# EAGLE design mainboard_ESP32 DevBoard (EAGLE 9.6.2)
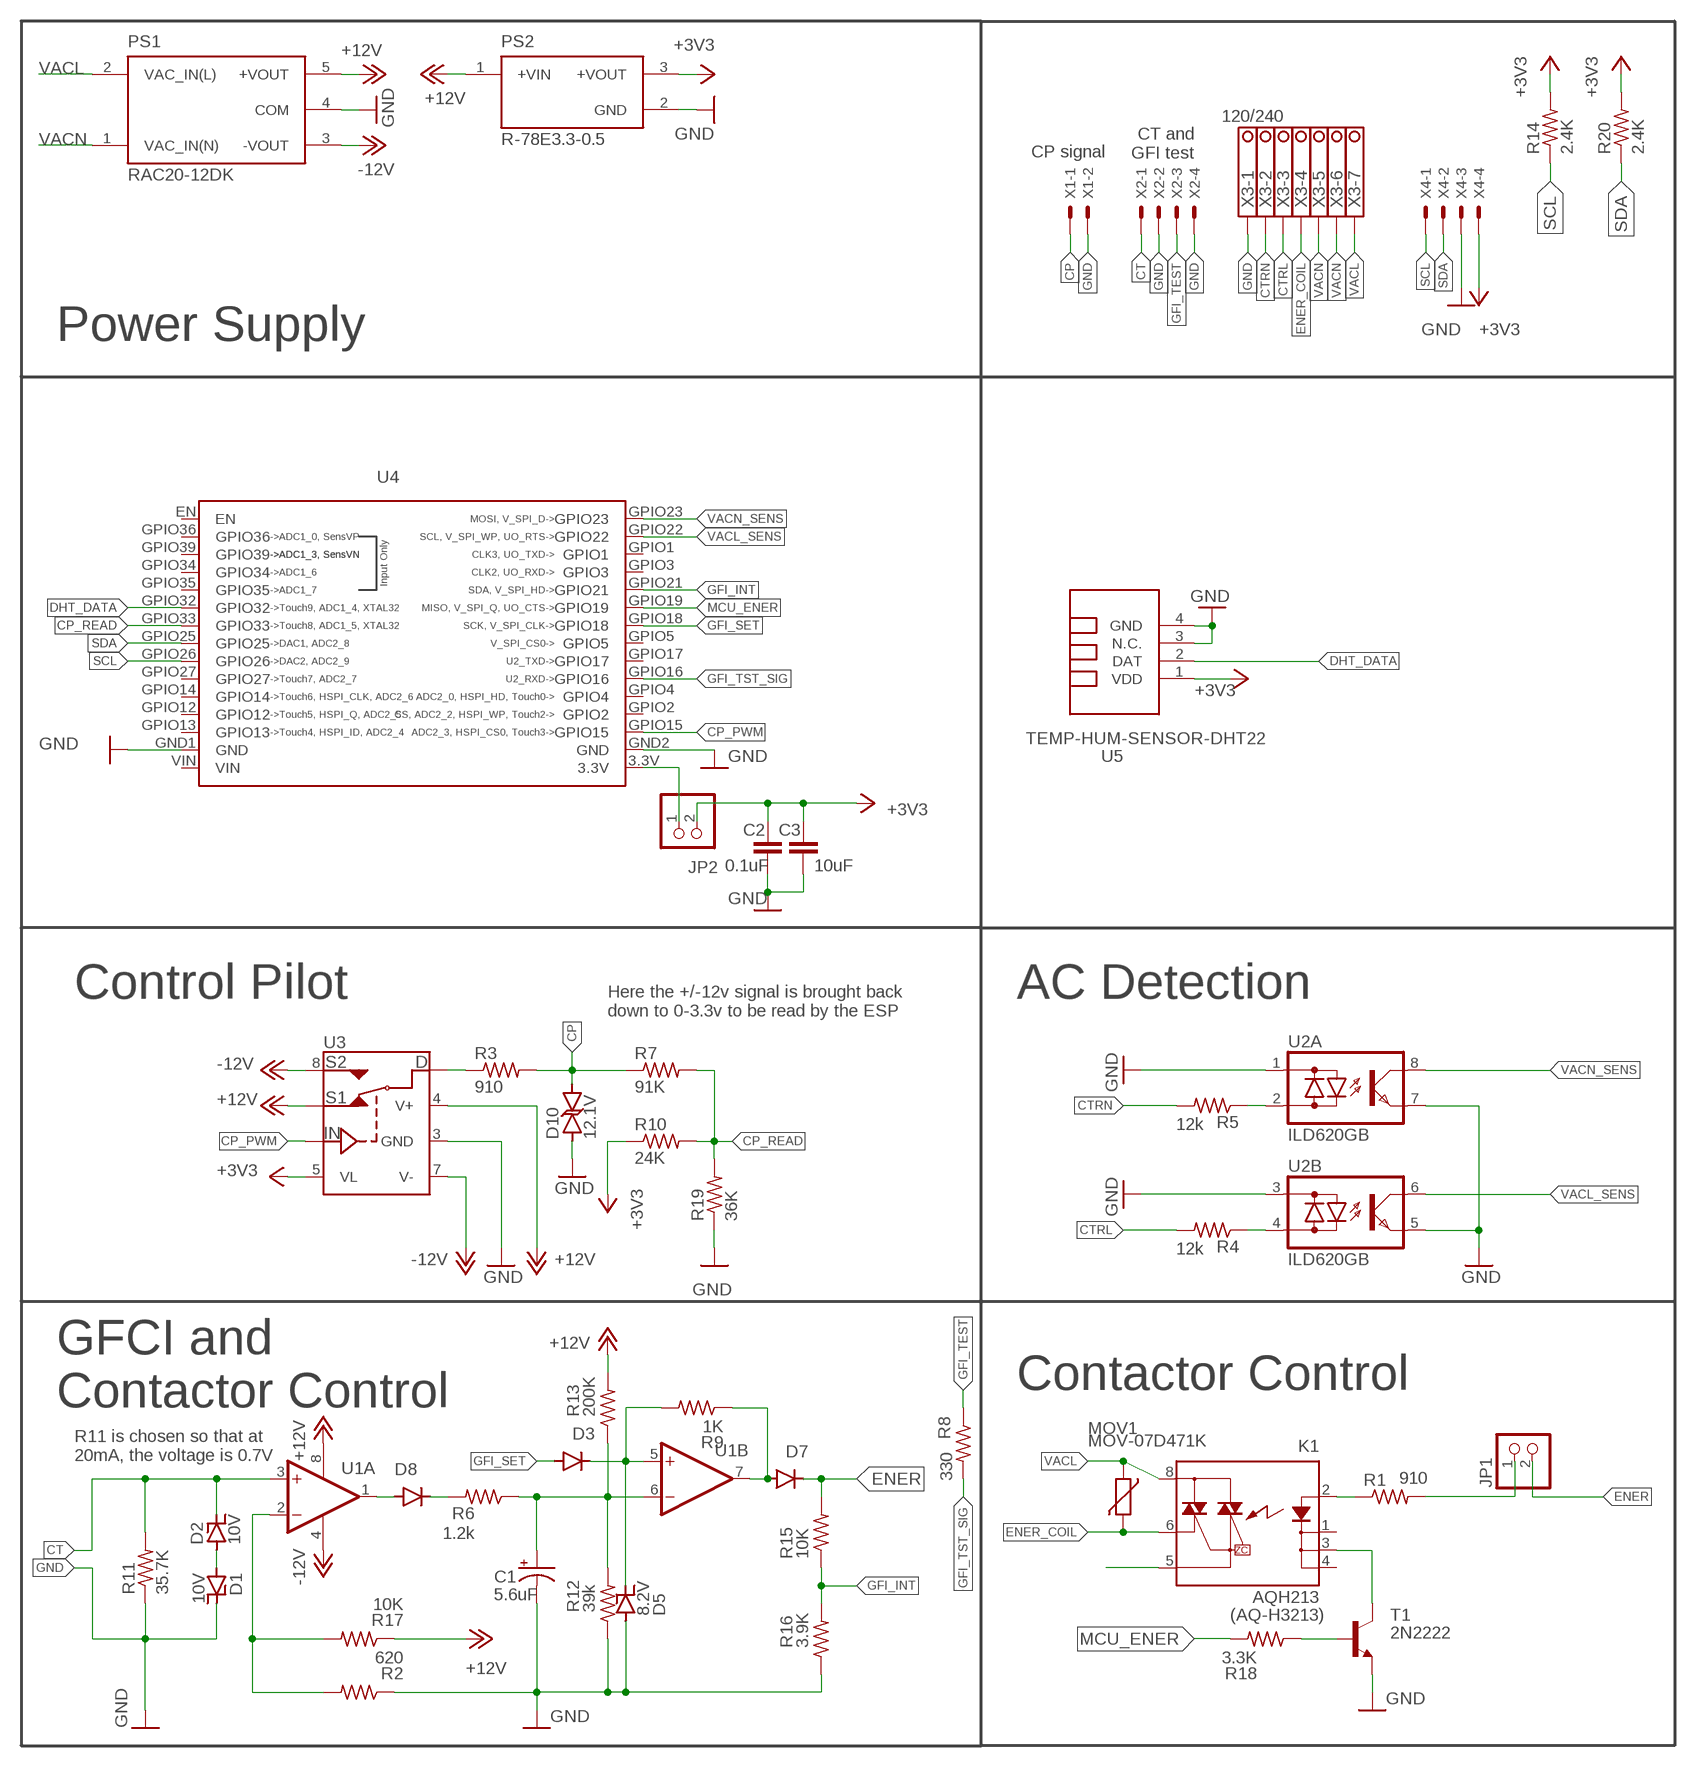
[diagram p0: schematic, sheet 1]

## Parts
C1  5.6uF  CPOL-USE2-5  [E2-5]
C2  0.1uF  C-EU025-025X050  [C025-025X050]
C3  10uF  C-EU025-050X050  [C025-050X050]
D1  10V  ZENER  [DO35-7]
D2  10V  ZENER  [DO35-7]
D3  1N4148DO35-7  [DO35-7]
D5  8.2V  ZENER  [DO35-7]
D7  1N4148DO35-7  [DO35-7]
D8  1N4148DO35-7  [DO35-7]
D10  12.1V  P6KE15CAL  [DO15]
JP1  PINHD-1X2  [1X02]
JP2  PINHD-1X2/90  [1X02/90]
K1  AQH213  [DIL07]
MOV1  MOV-07D471K  [DISC-7]
PS1  RAC20-12DK  [CONV_RAC20-12DK]
PS2  R-78E3.3-0.5  [CONV_R-78E3.3-0.5]
R1  910  RESISTORL  [0204/7-L]
R2  620  RESISTORL  [0204/7-L]
R3  910  RESISTORL  [0204/7-L]
R4  12k  RESISTORL  [0204/7-L]
R5  12k  RESISTORL  [0204/7-L]
R6  1.2k  RESISTORL  [0204/7-L]
R7  91K  RESISTORL  [0204/7-L]
R8  330  RESISTORL  [0204/7-L]
R9  1K  RESISTORL  [0204/7-L]
R10  24K  RESISTORL  [0204/7-L]
R11  35.7K  RESISTORL  [0204/7-L]
R12  39k  RESISTORL  [0204/7-L]
R13  200K  RESISTORL  [0204/7-L]
R14  2.4K  RESISTORL  [0204/7-L]
R15  10K  RESISTORL  [0204/7-L]
R16  3.9K  RESISTORL  [0204/7-L]
R17  10K  RESISTORL  [0204/7-L]
R18  3.3K  RESISTORL  [0204/7-L]
R19  36K  RESISTORL  [0204/7-L]
R20  2.4K  RESISTORL  [0204/7-L]
T1  2N2222  2N2222-NPN-TO92-EBC  [TO92-EBC]
U1  LM833N  [DIL08-LONG]
U2  ILD620GB  [DIL8]
U3  DG419DJ-L  [DIL08-LONG]
U4  ESP32-DOIT-V1  [ESP32-DOIT-V1]
U5  TEMP-HUM-SENSOR-DHT22  [TEMP-HUM-SENSOR-DHT22]
X1  JST-XH-02-PIN-LONG-PAD  [JST-XH-02-PACKAGE-LONG-PAD]
X2  JST-XH-04-PIN-LONG-PAD  [JST-XH-04-PACKAGE-LONG-PAD]
X3  1751293  [1751293]
X4  JST-XH-04-PIN-LONG-PAD  [JST-XH-04-PACKAGE-LONG-PAD]

## Nets
+3V3: C2.1 C3.1 JP2.2 PS2.3(+VOUT) R10.1 R14.2 R20.2 U3.5(VL) U5.1(VDD) X4.4
+12V: PS1.5(+VOUT) PS2.1(+VIN) R13.2 R17.1 U1.8(P:V+) U3.2(S1) U3.4(V+)
-12V: PS1.3(-VOUT) U1.4(P:V-) U3.7(V-) U3.8(S2)
CP: D10.C R3.2 R7.1 X1.1
CP_PWM: U3.6(IN) U4.GPIO15
CP_READ: R7.2 R10.2 R19.2 U4.GPIO33
CT: D2.C R11.2 U1.3(A:+IN) X2.1
CTRL [Mains]: R4.2 X3.3
CTRN [Mains]: R5.2 X3.2
DHT_DATA: U4.GPIO32 U5.2(DAT)
ENER: D7.C JP1.2 R15.2
ENER_COIL [Mains]: K1.6(DS3) MOV1.P$2 X3.4
GFI_INT: R15.1 R16.2 U4.GPIO21
GFI_SET: D3.A U4.GPIO18
GFI_TEST: R8.1 X2.3
GFI_TST_SIG: R8.2 U4.GPIO16
GND: C1.- C2.2 C3.2 D1.C D5.A D10.A PS1.4(COM) PS2.2(GND) R2.1 R11.1 R12.1 R16.1 R19.1 T1.E U2.1(A:AC1) U2.3(B:AC1) U2.5(B:E) U2.7(A:E) U3.3(GND) U4.GND1(GND) U4.GND2(GND) U5.3(N.C.) U5.4(GND) X1.2 X2.2 X2.4 X3.1 X4.3
MCU_ENER: R18.2 U4.GPIO19
N$1: K1.2(A) R1.1
N$2: R2.2 R17.2 U1.2(A:-IN)
N$3: JP1.1 R1.2
N$4: D7.A R9.1 U1.7(B:OUT)
N$5: D1.A D2.A
N$6: D8.C R6.2
N$8: R3.1 U3.1(D)
N$9: C1.+ R6.1 R12.2 R13.1 U1.6(B:-IN)
N$10: JP2.1 U4.3.3V
N$11 [Mains]: K1.5(DS2)
N$12: R18.1 T1.B
N$13: D3.C D5.C R9.2 U1.5(B:+IN)
N$14: K1.3(K1) T1.C
N$15: D8.A U1.1(A:OUT)
N$16 [Mains]: R5.1 U2.2(A:AC2)
N$17 [Mains]: R4.1 U2.4(B:AC2)
SCL: R14.1 U4.GPIO26 X4.1
SDA: R20.1 U4.GPIO25 X4.2
VACL [Mains]: K1.8(DS1) MOV1.P$1 PS1.2(VAC_IN(L)) X3.7
VACL_SENS: U2.6(B:C) U4.GPIO22
VACN [Mains]: PS1.1(VAC_IN(N)) X3.5 X3.6
VACN_SENS: U2.8(A:C) U4.GPIO23
Unconnected: K1.1(K) K1.4(K2) U4.EN U4.GPIO1 U4.GPIO2 U4.GPIO3 U4.GPIO4 U4.GPIO5 U4.GPIO12 U4.GPIO13 U4.GPIO14 U4.GPIO17 U4.GPIO27 U4.GPIO34 U4.GPIO35 U4.GPIO36 U4.GPIO39

## Notes on the sheet
- 120/240
- CT and
  GFI test
- CP signal
- Power Supply
- Control Pilot | AC Detection
- Here the +/-12v signal is brought back 
  down to 0-3.3v to be read by the ESP
- Contactor Control
- GFCI and 
  Contactor Control
- R11 is chosen so that at
  20mA, the voltage is 0.7V
- (AQ-H3213)

## Power pins joined to a net without a drawn wire
VIN: U4.VIN

## Library data of the parts
C1 = rcl:CPOL-US: POLARIZED CAPACITOR, American symbol; SPICEPREFIX: C
C2 C3 = rcl:C-EU: CAPACITOR, European symbol; SPICEPREFIX: C
D1 D2 D5 = Passive:ZENER
D3 D7 D8 = diode:1N4148: DIODE high speed (Philips)
D10 = EVSE:P6KE15CA
JP1 JP2 = pinhead:PINHD-1X2: PIN HEADER
K1 = relay:AQH*213: SOLID STATE RELAY NAiS Source: http://www.mew-europe.com/.. en_ds_61613_0000.pdf; OC_FARNELL: unknown; OC_NEWARK: unknown
MOV1 = EVSE:MOV-07D471K
PS1 = EVSE:RAC20-12DK: AC/DC CONVERTER 5V 20W, DUAL; DESCRIPTION: 20W AC/DC-Converter 'POWERLINE' 2x1 3kV reg; DIGI-KEY_PART_NUMBER: 945-3239-ND; DIGI-KEY_PURCHASE_URL: https://www.digikey.com/product-detail/en/recom-power/RAC20-12DK/945-3239-ND/9644720?utm_source=snapeda&utm_medium=aggregator&utm_campaign=symbol; MF: Recom Power; MP: RAC20-12DK; PACKAGE: DIP-5 Recom Power
PS2 = EVSE:R-78E3.3-0.5: 0.5 Amp SIP3 Single Output; DESCRIPTION: 0.5A DC/DC-Converter 'INNOLINE' SIP3 reg; DIGI-KEY_PART_NUMBER: 945-1661-5-ND; DIGI-KEY_PURCHASE_URL: https://www.digikey.com/product-detail/en/recom-power/R-78E3.3-0.5/945-1661-5-ND/3593412?utm_source=snapeda&utm_medium=aggregator&utm_campaign=symbol; MF: Recom Power; MP: R-78E3.3-0.5; PACKAGE: SIP-3 Recom Power
R1-R20 = Passive:RESISTOR
T1 = transistor-neu-to92:*-NPN-: NPN Transistror
U1 = EVSE:LM833
U2 = EVSE:ILD620
U3 = EVSE:DG419: The DG419 is single-pole/double-throw (SPDT) with one normally closed switch and one normally open switch. Switching times are less than 175ns max for tON and less than 145ns max for tOFF. Operation is from a single +10V to +30V supply, or bipolar ±4.5V to ±20V supplies. The improved DG417/DG418/DG419 are fabricated with a 44V silicon-gate process. MAXIM <https://www.maximintegrated.com/en/products/analog/analog-switches-multiplexers/DG419.html>
U4 = ESP32:ESP32-DOIT-V1: ESP32 DOIT dev board V1. Dimensions measure with calipers.
U5 = diy-modules:TEMP-HUM-SENSOR-DHT22: DHT22 - digital humidity & temperature sensor Also known as: AM2302 AM2302 datasheet available here: http://akizukidenshi.com/download/ds/aosong/AM2302.pdf Click here to find device on ebay.com <http://www.ebay.com/sch/dht22+digital+sensor>
X1 = Rembrandt Electronics - JST XH Connectors v1-0:JST-XH-02-PIN: JST XH Connector 2 Pin Wire to board connector. Pitch: 2,54 mm, (0.100") Number of pins: 2 Created by Rembrandt Electronics www.rembrandtelectronics.com
X2 X4 = Rembrandt Electronics - JST XH Connectors v1-0:JST-XH-04-PIN: JST XH Connector 2 Pin Wire to board connector. Pitch: 2,54 mm, (0.100") Number of pins: 4 Created by Rembrandt Electronics www.rembrandtelectronics.com
X3 = con-phoenix-350:1751293: MKDS 1/ 7-3,5 Printklemme Nennstrom: 10 A Bemessungsspannung: 160 V Raster: 3,5 mm Polzahl: 7 Montageart: Löten Anschlussart: Schraubanschluss Anschlussrichtung vom Leiter zur Platine: 0° Source: http://eshop.phoenixcontact.com .. 1751293.pdf; OC_FARNELL: unknown; OC_NEWARK: unknown

## Net classes
1 Mains: clearance 1.2 mm

## Board
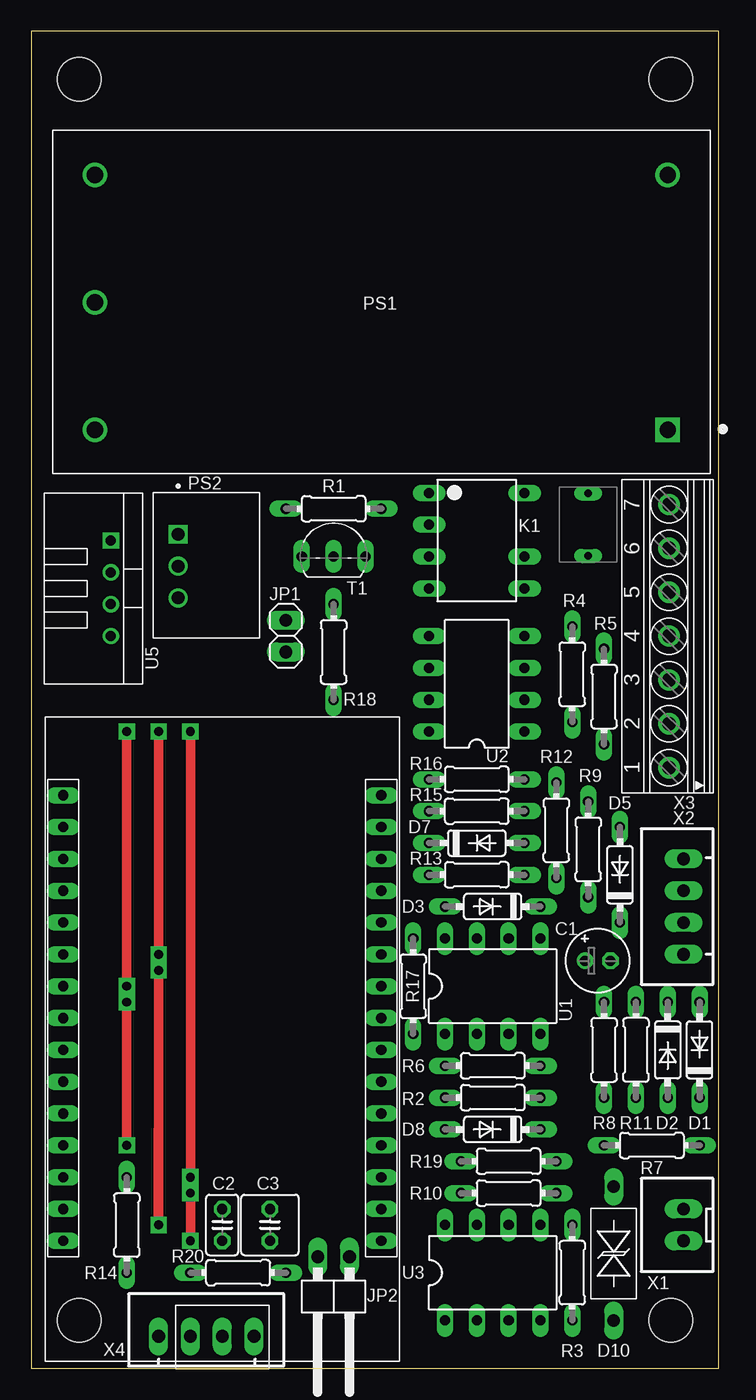
[diagram p1: board, top side]
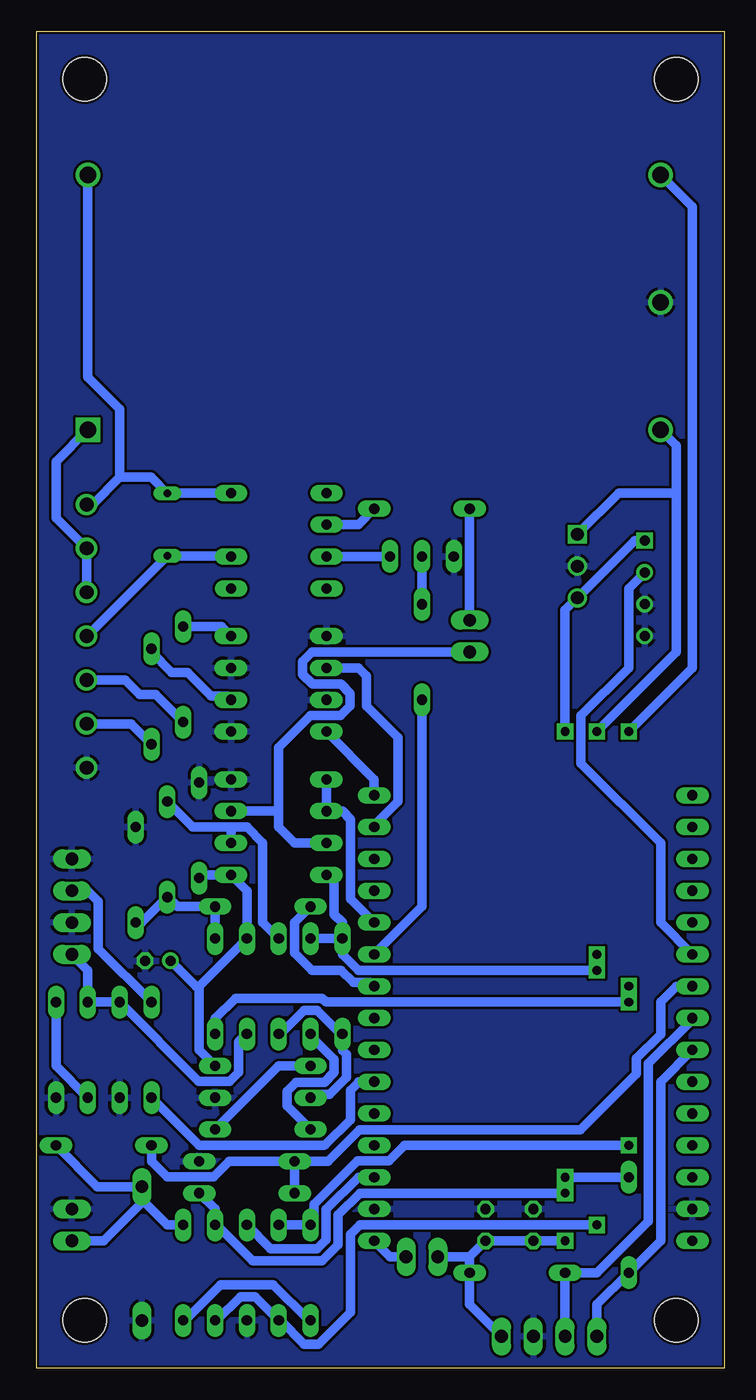
[diagram p2: board, bottom side, seen from below]

Size 54.86 x 106.68 mm. Coordinates in mm from the lower left corner, seen from the top.
Outline: 0,0 54.86,0 54.86,106.68 0,106.68 0,0
Copper layers (1*16): Top 0.035mm / dielectric 1.5mm / Bottom 0.035mm
Design rules "CNC *": minimum track width 0.25mm, minimum drill 0.6mm, track to track 0.2mm, track to pad 0.2mm, pad to pad 6mil, via to via 0.2mm, smd to smd 0.15mm, copper to edge 0.15mm, drill to drill 6mil, minimum pad ring 0.25mm, minimum via ring 0.3mm, stop-mask expansion 4mil, vias tented up to drill 0mil, thermal gap 10mil
Holes 3.5 mm at 3.81,3.81 51.05,3.81 51.05,102.87 3.81,102.87

### Footprints (pad centres in the part's own frame; a part is rotated, then mirrored left to right if it is on the bottom)
E2-5 = drill 0.813 pad 1.27: + -1.016,0 | drill 0.813 pad 1.27 octagon: - 1.016,0
C025-025X050 = drill 0.813 octagon: 1 -1.27,0; 2 1.27,0
C025-050X050 = drill 0.813 octagon: 1 -1.27,0; 2 1.27,0
DO35-7 = drill 0.813 long: A 3.81,0; C -3.81,0
DO15 = drill 1 long: A 5.334,0; C -5.334,0
1X02 = drill 1.016 long: 1 -1.27,0; 2 1.27,0
1X02/90 = drill 1.016 long: 1 -1.27,-3.81; 2 1.27,-3.81
DIL07 = drill 0.8 long: 1 -3.81,-3.81; 2 -1.27,-3.81; 3 1.27,-3.81; 4 3.81,-3.81; 5 3.81,3.81; 6 1.27,3.81; 8 -3.81,3.81
DISC-7 = drill 0.6 long: P$1 -2.5,0; P$2 2.5,0
CONV_RAC20-12DK = drill 1.3 pad 1.95 square: 1 -22.86,10.2 | drill 1.3 pad 1.95: 2 -22.86,-10.12; 3 22.86,-10.12; 4 22.86,0.04; 5 22.86,10.2
CONV_R-78E3.3-0.5 = drill 1 square: 1 -2.54,-2.25 | drill 1: 2 0,-2.25; 3 2.54,-2.25
0204/7-L = drill 0.813 long: 1 -3.81,0; 2 3.81,0
TO92-EBC = drill 0.813 long: B 0,-1.27; C 2.54,-1.27; E -2.54,-1.27
DIL08-LONG = drill 0.813 long: 1 -3.81,-3.81; 2 -1.27,-3.81; 3 1.27,-3.81; 4 3.81,-3.81; 5 3.81,3.81; 6 1.27,3.81; 7 -1.27,3.81; 8 -3.81,3.81
DIL8 = drill 0.813 long: 1 -3.81,-3.81; 2 -1.27,-3.81; 3 1.27,-3.81; 4 3.81,-3.81; 5 3.81,3.81; 6 1.27,3.81; 7 -1.27,3.81; 8 -3.81,3.81
ESP32-DOIT-V1 = drill 0.813 long: 3.3V 12.7,-15.24; EN -12.7,20.32; GND1 -12.7,-12.7; GND2 12.7,-12.7; GPIO1 12.7,15.24; GPIO2 12.7,-7.62; GPIO3 12.7,12.7; GPIO4 12.7,-5.08; GPIO5 12.7,2.54; GPIO12 -12.7,-7.62; GPIO13 -12.7,-10.16; GPIO14 -12.7,-5.08; GPIO15 12.7,-10.16; GPIO16 12.7,-2.54; GPIO17 12.7,0; GPIO18 12.7,5.08; GPIO19 12.7,7.62; GPIO21 12.7,10.16; GPIO22 12.7,17.78; GPIO23 12.7,20.32; GPIO25 -12.7,2.54; GPIO26 -12.7,0; GPIO27 -12.7,-2.54; GPIO32 -12.7,7.62; GPIO33 -12.7,5.08; GPIO34 -12.7,12.7; GPIO35 -12.7,10.16; GPIO36 -12.7,17.78; GPIO39 -12.7,15.24; VIN -12.7,-15.24
TEMP-HUM-SENSOR-DHT22 = drill 0.8 square: 1 -3.81,0 | drill 0.8: 2 -1.27,0; 3 1.27,0; 4 3.81,0
JST-XH-02-PACKAGE-LONG-PAD = drill 1.016 long: 1 -1.27,0; 2 1.27,0
JST-XH-04-PACKAGE-LONG-PAD = drill 1.016 long: 1 -3.81,0; 2 -1.27,0; 3 1.27,0; 4 3.81,0
1751293 = drill 1.1 pad 1.7: 1 -10.5,-0.1; 2 -7,-0.1; 3 -3.5,-0.1; 4 0,-0.1; 5 3.5,-0.1; 6 7,-0.1; 7 10.5,-0.1

### Placement (x,y rotation side)
C1  45.21,32.51 0 top
C2  15.24,11.43 90 top
C3  19.05,11.43 90 top
D1  53.34,25.4 90 top
D2  50.8,25.4 270 top
D3  36.83,36.83 180 top
D5  46.99,39.37 90 top
D7  35.56,41.91 0 top
D8  36.83,19.05 180 top
D10  46.48,9.14 270 top
JP1  20.32,58.42 270 top
JP2  24.13,5.08 180 top
K1  35.56,66.04 270 top
MOV1  44.45,67.31 270 top
PS1  27.94,85.09 180 top
PS2  13.97,64.01 270 top
R1  24.13,68.58 180 top
R2  36.83,21.59 180 top
R3  43.18,7.62 90 top
R4  43.18,55.37 270 top
R5  45.72,53.59 270 top
R6  36.83,24.13 180 top
R7  49.53,17.78 180 top
R8  45.72,25.4 270 top
R9  44.45,41.4 270 top
R10  38.1,13.97 180 top
R11  48.26,25.4 90 top
R12  41.91,42.93 270 top
R13  35.56,39.37 180 top
R14  7.62,11.43 90 top
R15  35.56,44.45 0 top
R16  35.56,46.99 180 top
R17  30.48,30.48 270 top
R18  24.13,57.15 270 top
R19  38.1,16.51 180 top
R20  16.51,7.62 0 top
T1  24.13,66.04 0 top
U1  36.83,30.48 0 top
U2  35.56,54.61 90 top
U3  36.83,7.62 0 top
U4  15.24,25.4 0 top
U5  6.35,62.23 270 top
X1  52.07,11.43 90 top
X2  52.07,36.83 90 top
X3  50.8,58.42 90 top
X4  13.97,2.54 0 top

### Tracks (layer width: path | path; a pad name or v marks a point on that pad's centre or on a via)
+3V3  (via drill 0.7)
  Top 0.762: v12.7,13.97 v12.7,10.16 | v12.7,15.24 v12.7,50.8
  Bottom 0.762: U5.1 7.15,66.04 PS2.3 12.7,60.49 v12.7,50.8 | v12.7,10.16 C2.1 C3.1 20.32,8.89 | X4.4 20.32,5.08 R20.2 20.32,8.89 | 20.32,8.89 JP2.2 | R10.1 40.64,12.7 U3.5 40.51,11.43 37.65,8.57 32.11,8.57 30.82,9.86 30.82,12.23 29.08,13.97 v12.7,13.97 v12.7,15.24 R14.2
+12V  (via drill 0.7)
  Top 0.762: 10.16,19.05 v10.16,31.75 v10.16,33.02 v10.16,50.8
  Top 0.813: v10.16,11.43 10.16,19.05
  Bottom 0.762: U1.8 R17.1 | v10.16,50.8 3.81,57.15 3.81,69.85 | PS1.5 3.81,73.62 3.81,69.85 | PS2.1 8.42,69.85 3.81,69.85 | v10.16,11.43 29.08,11.43 29.83,10.67 29.83,4.46 32.37,1.92 33.53,1.92 35.43,3.81 U3.2 37.45,5.7 38.61,5.7 40.51,3.81 U3.4 | R17.1 30.48,33.02 29.21,31.75 v10.16,31.75 v10.16,33.02 | R17.1 30.48,35.56 31.13,36.21 31.13,38.75 R13.2
-12V  (via drill 0.7)
  Top 0.762: v7.62,50.8 v7.62,30.48 | v7.62,17.78 v7.62,29.21
  Bottom 0.762: v7.62,50.8 2.54,55.88 2.54,92.67 PS1.3 | v7.62,30.48 v7.62,29.21 31.79,29.21 32.11,29.53 39.01,29.53 40.64,27.9 U1.4 | U3.7 U3.8 32.74,11.71 32.74,12.7 32.74,13.07 29.27,16.54 26.77,16.54 25.53,17.78 v7.62,17.78
CP
  Bottom 0.762: R3.2 44.45,11.43 46.48,13.46 D10.C | D10.C 46.48,13.21 49.53,10.16 X1.1 | R7.1 50.04,14.48 D10.C
CP_PWM
  Bottom 0.762: U4.GPIO15 29.21,15.24 31.78,12.67 31.78,10.26 32.51,9.54 36.21,9.54 U3.6
CP_READ
  Bottom 0.762: U4.GPIO33 3.81,30.48 5.08,29.21 5.08,26.63 7,24.7 7,23.48 11.46,19.02 29.11,19.02 31.62,16.51 R19.2 | R19.2 R10.2 | R19.2 39.5,16.51 40.74,15.27 44.48,15.27 45.72,16.51 R7.2
CT
  Bottom 0.762: X2.1 50.8,31.75 D2.C R11.2 41.94,22.89 39.47,22.89 38.75,23.62 38.75,26.02 U1.3
CTRL
  Bottom 0.762: R4.2 45.37,53.75 46.65,53.75 47.82,54.92 X3.3
CTRN
  Bottom 0.762: R5.2 47.36,51.42 X3.2
DHT_DATA
  Bottom 0.762: U4.GPIO32 5.08,35.56 5.08,41.91 11.43,48.26 11.43,52.07 7.62,55.88 7.62,62.23 U5.2
ENER
  Bottom 0.762: 35.56,44.45 R15.2 | 35.56,44.45 35.56,49.53 33.02,52.07 30.61,52.07 29.86,52.83 29.86,53.85 30.58,54.58 32.85,54.58 33.64,55.37 33.64,56.39 32.89,57.15 JP1.2 | D7.C 34.29,41.91 35.56,43.18 35.56,44.45
ENER_COIL
  Bottom 0.762: K1.6 39.41,64.81 MOV1.P$2 50.84,58.42 X3.4
GFI_INT
  Bottom 0.762: R16.2 R15.1 30.48,44.45 29.83,43.8 29.83,37.45 U4.GPIO21
GFI_SET
  Bottom 0.762: D3.A 34.29,35.56 34.29,33.15 32.89,31.75 30.57,31.75 29.61,30.79 28.25,30.79 U4.GPIO18
GFI_TEST
  Bottom 0.762: X2.3 50.8,38.1 49.97,37.27 49.97,33.45 R8.1
GFI_TST_SIG
  Bottom 0.762: R8.2 41.91,17.78 31.93,17.78 31.9,17.81 31.85,17.81 29.83,19.83 29.83,22.19 29.2,22.82 29.2,22.86 U4.GPIO16
GND
  pour Bottom (isolate 0.2): -1.27,109.22 57.15,109.22 57.15,-2.54 -2.54,-2.54 -2.54,109.22
MCU_ENER
  Bottom 0.762: U4.GPIO19 24.12,36.84 R18.2
N$1
  Bottom 0.762: K1.2 29.21,67.31 R1.1
N$2
  Bottom 0.762: U1.2 35.43,26.67 33.53,28.56 32.51,28.56 30.61,26.67 R17.2 30.48,25.36 30.16,25.04 30.16,23.22 31.52,21.86 32.74,21.86 R2.2
N$3
  Bottom 0.762: JP1.1 R1.2
N$4
  Bottom 0.762: U1.7 36.83,35.56 36.83,41.91 38.1,43.18 39.37,43.18 | R9.1 42.42,43.18 39.37,43.18 | D7.A 39.37,43.18
N$5
  Bottom 0.762: D2.A 53.34,24.13 D1.A
N$6
  Bottom 0.762: R6.2 35.56,24.13 D8.C
N$8
  Bottom 0.762: R3.1 43.05,3.81 40.19,6.67 36.01,6.67 33.15,3.81 U3.1
N$9
  Bottom 0.762: R12.2 41.66,39.37 R13.1 38.1,38.1 U1.6 41.91,30.48 | R6.1 41.91,25.4 41.91,30.48 | C1.+ 42.16,30.48 41.91,30.48
N$10
  Bottom 0.762: JP2.1 26.67,8.89 U4.3.3V
N$12
  Bottom 0.762: R18.1 T1.B
N$13
  Bottom 0.762: U1.5 D3.C 43.69,36.83 R9.2 46.48,35.56 D5.C
N$14
  Bottom 0.762: K1.3 T1.C
N$15
  Bottom 0.762: U1.1 33.02,26.54 31.13,24.64 31.13,23.62 31.92,22.83 34.19,22.83 34.91,22.1 34.91,20.94 D8.A
N$16
  Bottom 0.762: U2.2 39.67,53.64 40.95,53.64 42.84,55.53 44.11,55.53 45.72,57.14 R5.1
N$17
  Bottom 0.762: U2.4 40.13,59.18 R4.1
SCL
  Bottom 0.762: U4.GPIO26 5.08,22.86 5.08,10.16 R14.1 10.16,5.08 X4.1
SDA
  Bottom 0.762: U4.GPIO25 2.54,27.81 6.04,24.3 6.04,11.74 10.16,7.62 R20.1 X4.2
VACL
  Bottom 0.762: PS1.2 50.8,79.08 48.24,76.52 48.24,71.1 | X3.7 50.43,68.92 48.24,71.1 | K1.8 44.41,69.85 MOV1.P$1 45.74,71.1 48.24,71.1
VACL_SENS
  Bottom 0.762: U4.GPIO22 27.94,43.31 26.05,45.21 26.05,50.31 28.56,52.83 28.56,55.23 29.21,55.88 U2.6
VACN
  Bottom 0.762: PS1.1 53.33,72.36 53.33,67.85 X3.6 X3.5
VACN_SENS
  Bottom 0.762: U4.GPIO23 27.94,46.99 U2.8